# EAGLE schematic ESP32_base_brd (EAGLE 9.6.2)
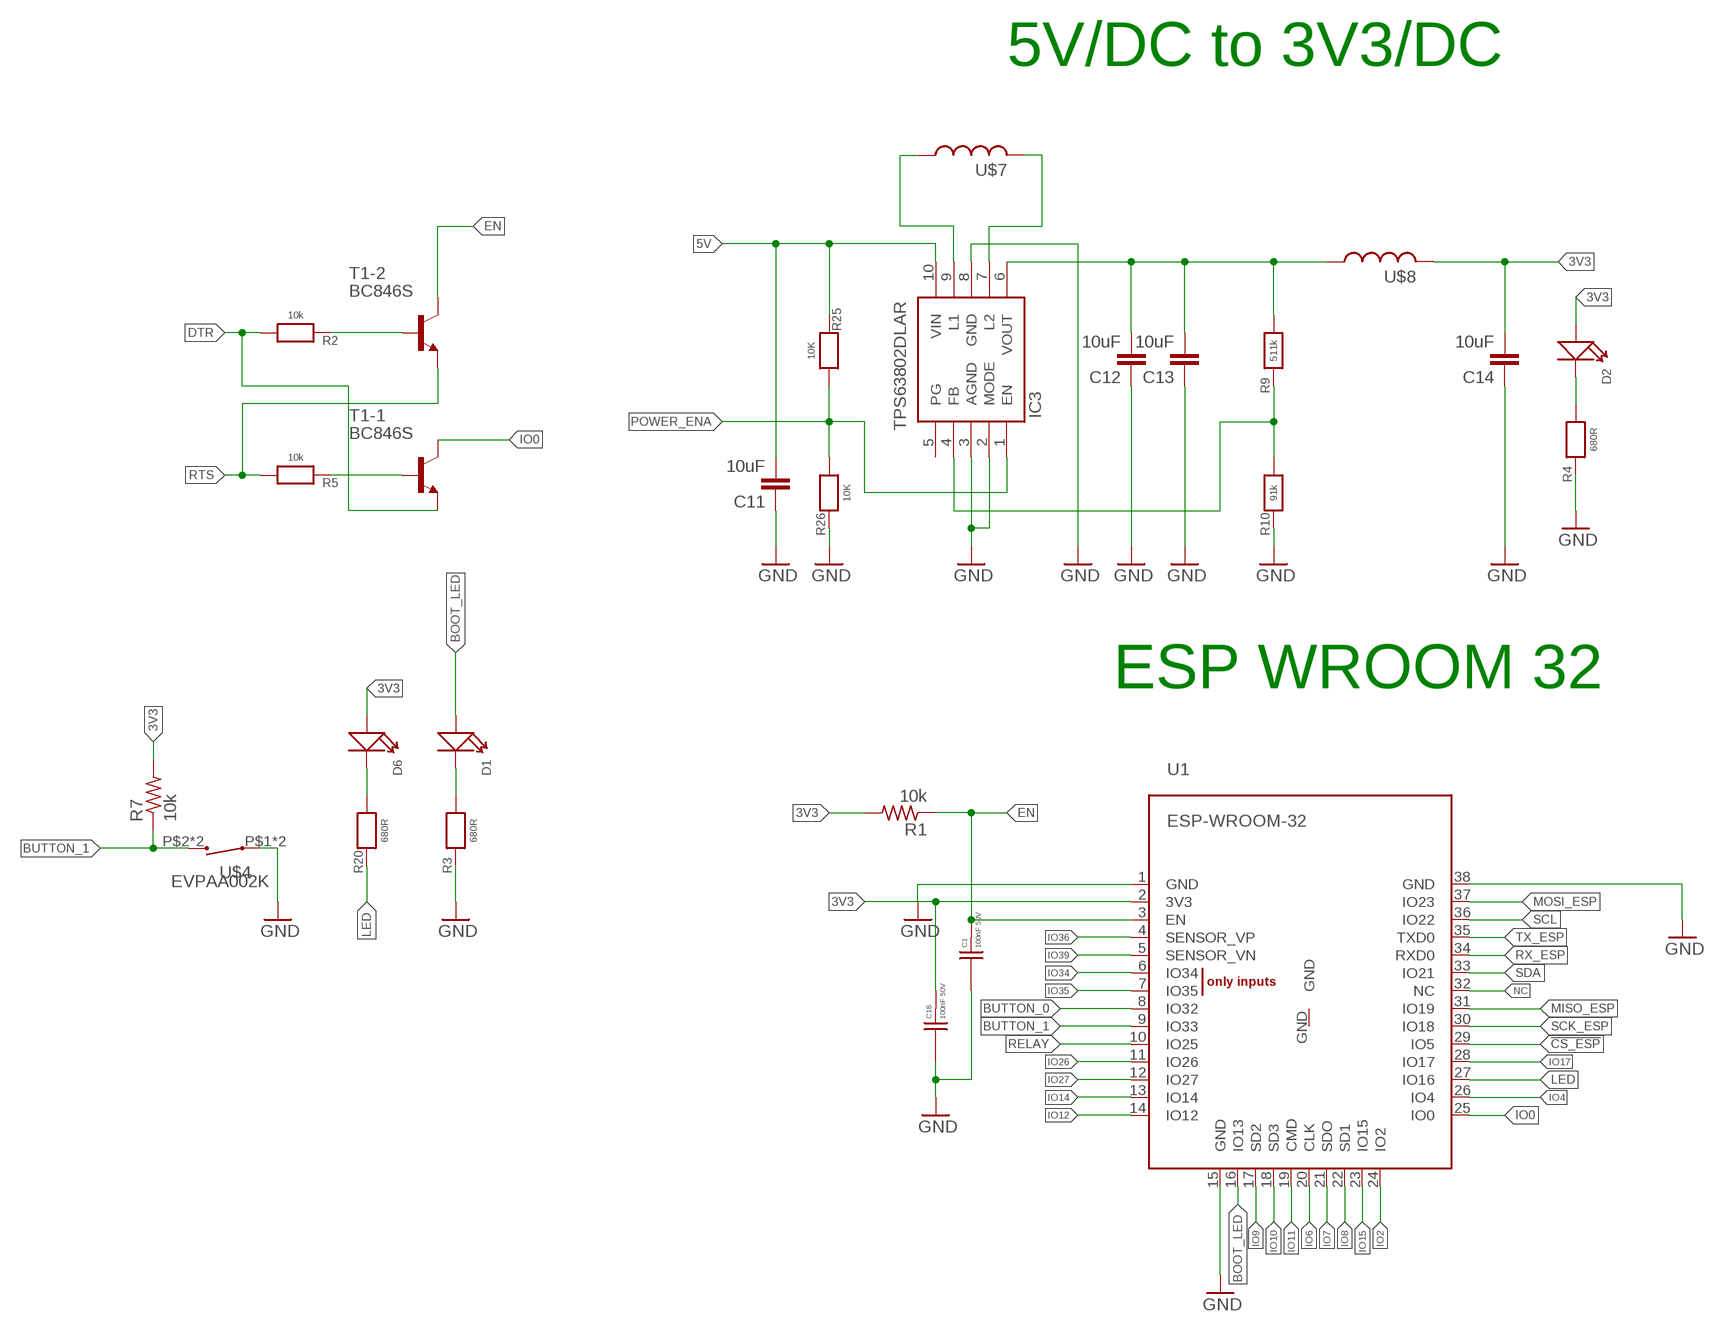
[diagram p0: schematic, sheet 1]

## Parts
C1  100nF 50V  CAPACITOR_CERAMIC_0402_100NF  [0402]
C11  10uF  C-EUC0603  [C0603]
C12  10uF  C-EUC0603  [C0603]
C13  10uF  C-EUC0603  [C0603]
C14  10uF  C-EUC0603  [C0603]
C18  100nF 50V  CAPACITOR_CERAMIC_0402_100NF  [0402]
D1  SMD-LED-YELLOW-DIFFUSED-PURE-WHITE(0402)  [LED-0402]
D2  SMD-LED-YELLOW-DIFFUSED-PURE-WHITE(0402)  [LED-0402]
D6  SMD-LED-YELLOW-DIFFUSED-PURE-WHITE(0402)  [LED-0402]
IC3  TPS63802DLAR  [TPS63802DLAR]
R1  10k  R-US_R0805  [R0805]
R2  10k  RESISTOR_0402  [0402]
R3  680R  RESISTOR_0402  [0402]
R4  680R  RESISTOR_0402  [0402]
R5  10k  RESISTOR_0402  [0402]
R7  10k  R-US_R0805  [R0805]
R9  511k  RESISTOR_0402  [0402]
R10  91k  RESISTOR_0402  [0402]
R20  680R  RESISTOR_0402  [0402]
R25  10K  RESISTOR_0402  [0402]
R26  10K  RESISTOR_0402  [0402]
T1  BC846S  [SOT363]
U1  ESP-WROOM-32  [ESP-WROOM-32]
U$4  EVPAA002K  [EVPAA002K]
U$7  INDUCTOR_2016  [2016]
U$8  INDUCTOR_2016  [2016]

## Nets
3V3: C14.2 C18.2 D2.+ D6.+ R1.2 R7.2 U1.2(3V3) U$8.2
5V: C11.2 IC3.10(VIN) R25.1
!CS_ESP: U1.29(IO5)
BOOT_LED: D1.+ U1.16(IO13)
BUTTON_0: U1.8(IO32)
BUTTON_1: R7.1 U1.9(IO33) U$4.P$2 U$4.P$4
DTR: R2.2 T1.1(-1:E)
EN: C1.2 R1.1 T1.3(-2:C) U1.3(EN)
GND: C1.1 C11.1 C12.1 C13.1 C14.1 C18.1 IC3.2(MODE) IC3.3(AGND) IC3.8(GND) R3.1 R4.1 R10.1 R26.1 U1.1(GND) U1.15(GND) U1.38(GND) U$4.P$1 U$4.P$3
IO0: T1.6(-1:C) U1.25(IO0)
IO2: U1.24(IO2)
IO4: U1.26(IO4)
IO6: U1.20(CLK)
IO7: U1.21(SDO)
IO8: U1.22(SD1)
IO9: U1.17(SD2)
IO10: U1.18(SD3)
IO11: U1.19(CMD)
IO12: U1.14(IO12)
IO14: U1.13(IO14)
IO15: U1.23(IO15)
IO17: U1.28(IO17)
IO26: U1.11(IO26)
IO27: U1.12(IO27)
IO34: U1.6(IO34)
IO35: U1.7(IO35)
IO36: U1.4(SENSOR_VP)
IO39: U1.5(SENSOR_VN)
LED: R20.1 U1.27(IO16)
MISO_ESP: U1.31(IO19)
MOSI_ESP: U1.37(IO23)
N$1: R2.1 T1.5(-2:B)
N$2: R5.1 T1.2(-1:B)
N$7: D1.- R3.2
N$8: D2.- R4.2
N$10: IC3.9(L1) U$7.1
N$11: IC3.7(L2) U$7.2
N$12: C12.2 C13.2 IC3.6(VOUT) R9.2 U$8.1
N$13: IC3.4(FB) R9.1 R10.2
N$61: D6.- R20.2
NC: U1.32(NC)
POWER_ENA: IC3.1(EN) R25.2 R26.2
RELAY: U1.10(IO25)
RTS: R5.2 T1.4(-2:E)
RX_ESP: U1.34(RXD0)
SCK_ESP: U1.30(IO18)
SCL: U1.36(IO22)
SDA: U1.33(IO21)
TX_ESP: U1.35(TXD0)
Unconnected: IC3.5(PG) U1.GND

## Notes on the sheet
- 5V/DC to 3V3/DC
- ESP WROOM 32

## Library data of the parts
C1 C18 = vb_C_EC:CAPACITOR_CERAMIC_0402_100NF; MPN: GPC0402104
C11-C14 = resistor:C-EU: CAPACITOR, European symbol
D1 D2 D6 = Seeed-LED:SMD-LED-YELLOW-DIFFUSED-PURE-WHITE(0402): 304090016; MPN: 16-219A/T2D-AR2T1QY/3T; VALUE: PURE-WHITE-0402
IC3 = TPS63802DLAR:TPS63802DLAR: Texas Instruments High current, high efficiency single inductor buck-boost converter 10-VSON-HR -40 to 125 Source: Datasheet <http://www.ti.com/lit/ds/symlink/tps63802.pdf>; DESCRIPTION: Texas Instruments High current, high efficiency single inductor buck-boost converter 10-VSON-HR -40 to 125; HEIGHT: 1mm; MANUFACTURER_NAME: Texas Instruments; MANUFACTURER_PART_NUMBER: TPS63802DLAR; MOUSER_PART_NUMBER: N/A; MOUSER_PRICE-STOCK: https://www.mouser.com/Search/Refine.aspx?Keyword=N%2FA
R1 R7 = adafruit:R-US_: RESISTOR, American symbol
R2-R5 R20 = vb_R_EC:RESISTOR_0402
R9 R10 R25 R26 = vb_R:RESISTOR_0402
T1 = BC846S:BC846S: Dual 65 V, 100 mA NPN/NPN general-purpose transistor AAL Eindhoven MK Check availability <https://pricing.snapeda.com/parts/BC846S/NXP%20Semiconductors/view-part?ref=eda>; AVAILABILITY: In Stock; DESCRIPTION: Bipolar (BJT) Transistor Array 2 NPN (Dual) 65V 100mA 100MHz 300mW Surface Mount 6-TSSOP; MF: NXP Semiconductors; MP: BC846S; PACKAGE: SOT-363 NXP Semiconductors; PRICE: None; PURCHASE-URL: https://pricing.snapeda.com/search/part/BC846S/?ref=eda
U1 = esp32:ESP-WROOM-32
U$4 = EVPAA002K:EVPAA002K
U$7 U$8 = vb_L:INDUCTOR_2016